# EAGLE design Tractive System Active Light rev6 (EAGLE 9.6.2)

## Sheet 1 of 2
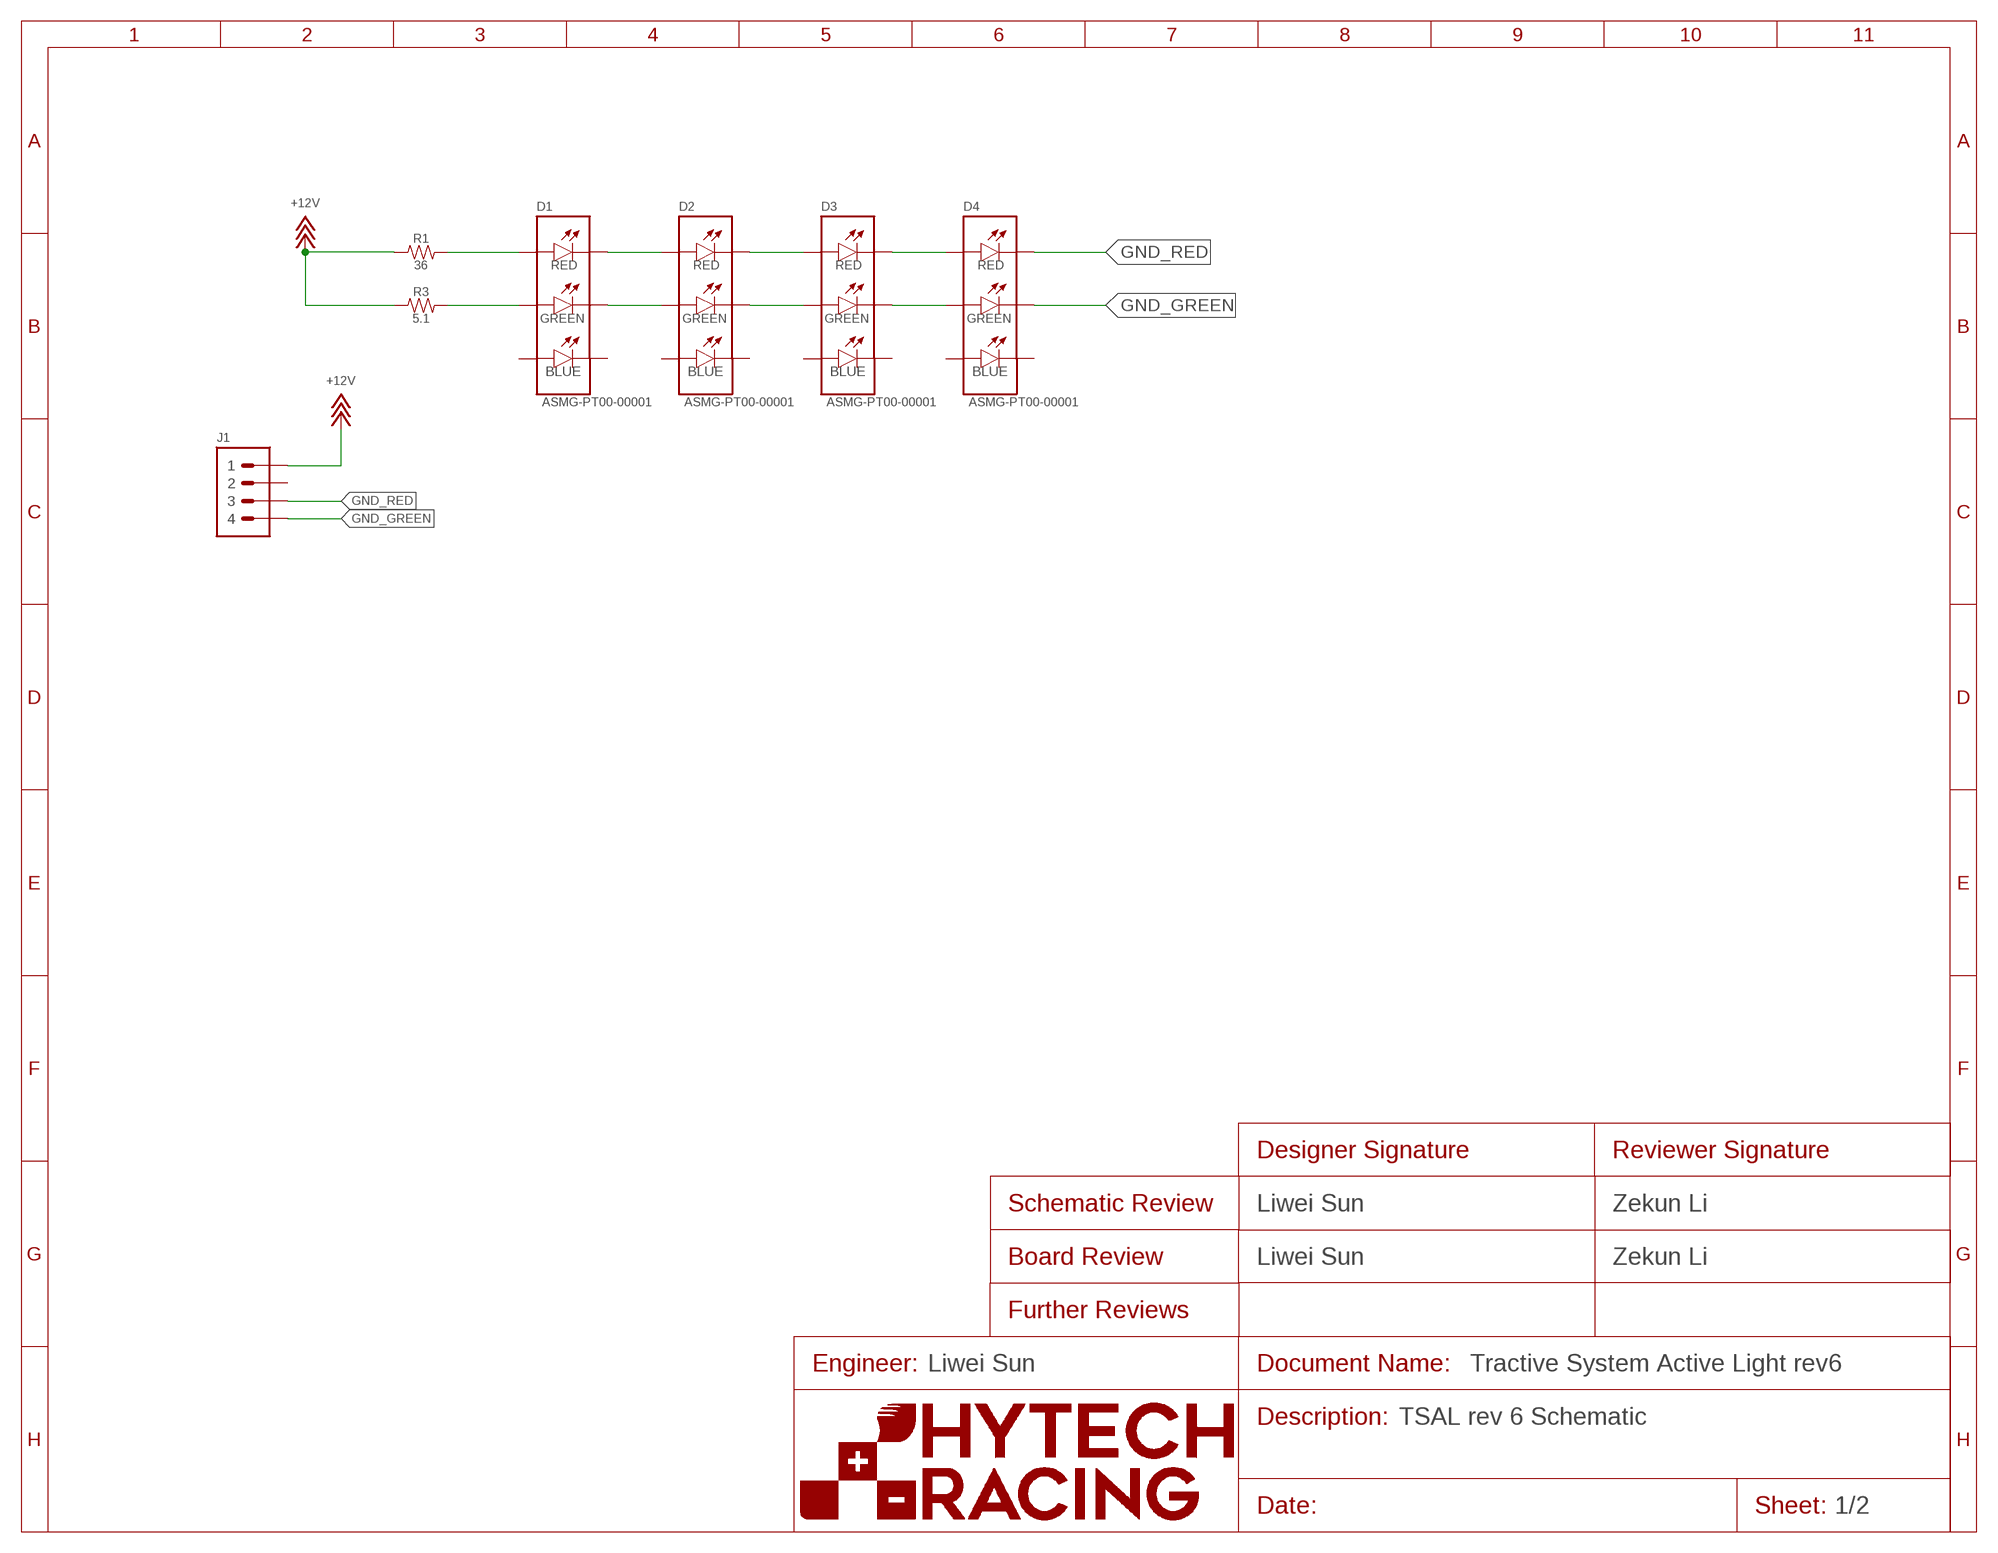
[diagram p0: schematic, sheet 1]
FRAME1 (FRAME): DESCRIPTION_1: TSAL rev 6 Schematic; DESIGNER_BOARD: Liwei Sun; DESIGNER_SCHEMATIC: Liwei Sun; ENGINEER: Liwei Sun; REVIEWER_BOARD: Zekun Li; REVIEWER_SCHEMATIC: Zekun Li

### Parts
D1  LED_RGB_ASMG-PT00-00001  [ASMG-PT00-00001]
D2  LED_RGB_ASMG-PT00-00001  [ASMG-PT00-00001]
D3  LED_RGB_ASMG-PT00-00001  [ASMG-PT00-00001]
D4  LED_RGB_ASMG-PT00-00001  [ASMG-PT00-00001]
J1  CONNECTOR-4_μF_S_RA_  [MOLEX_MICROFIT_SMD_RIGHTANGLE_04_DUAL]
R1  RESISTOR_0805_36  [0805-RES]
R3  RESISTOR_0805_5.1  [0805-RES]

### Nets
+12V: J1.1 R1.1 R3.1
GND_GREEN: D4.2(GREEN-) J1.4
GND_RED: D4.1(RED-) J1.3
N$1: D3.1(RED-) D4.4(RED+) D4.THERMAL(RED+)
N$2: D3.2(GREEN-) D4.5(GREEN+)
N$3: D2.1(RED-) D3.4(RED+) D3.THERMAL(RED+)
N$4: D2.2(GREEN-) D3.5(GREEN+)
N$5: D1.1(RED-) D2.4(RED+) D2.THERMAL(RED+)
N$6: D1.2(GREEN-) D2.5(GREEN+)
N$7: D1.4(RED+) D1.THERMAL(RED+) R1.2
N$9: D1.5(GREEN+) R3.2
Unconnected: D1.3(BLUE-) D1.6(BLUE+) D2.3(BLUE-) D2.6(BLUE+) D3.3(BLUE-) D3.6(BLUE+) D4.3(BLUE-) D4.6(BLUE+) J1.2

## Sheet 2 of 2
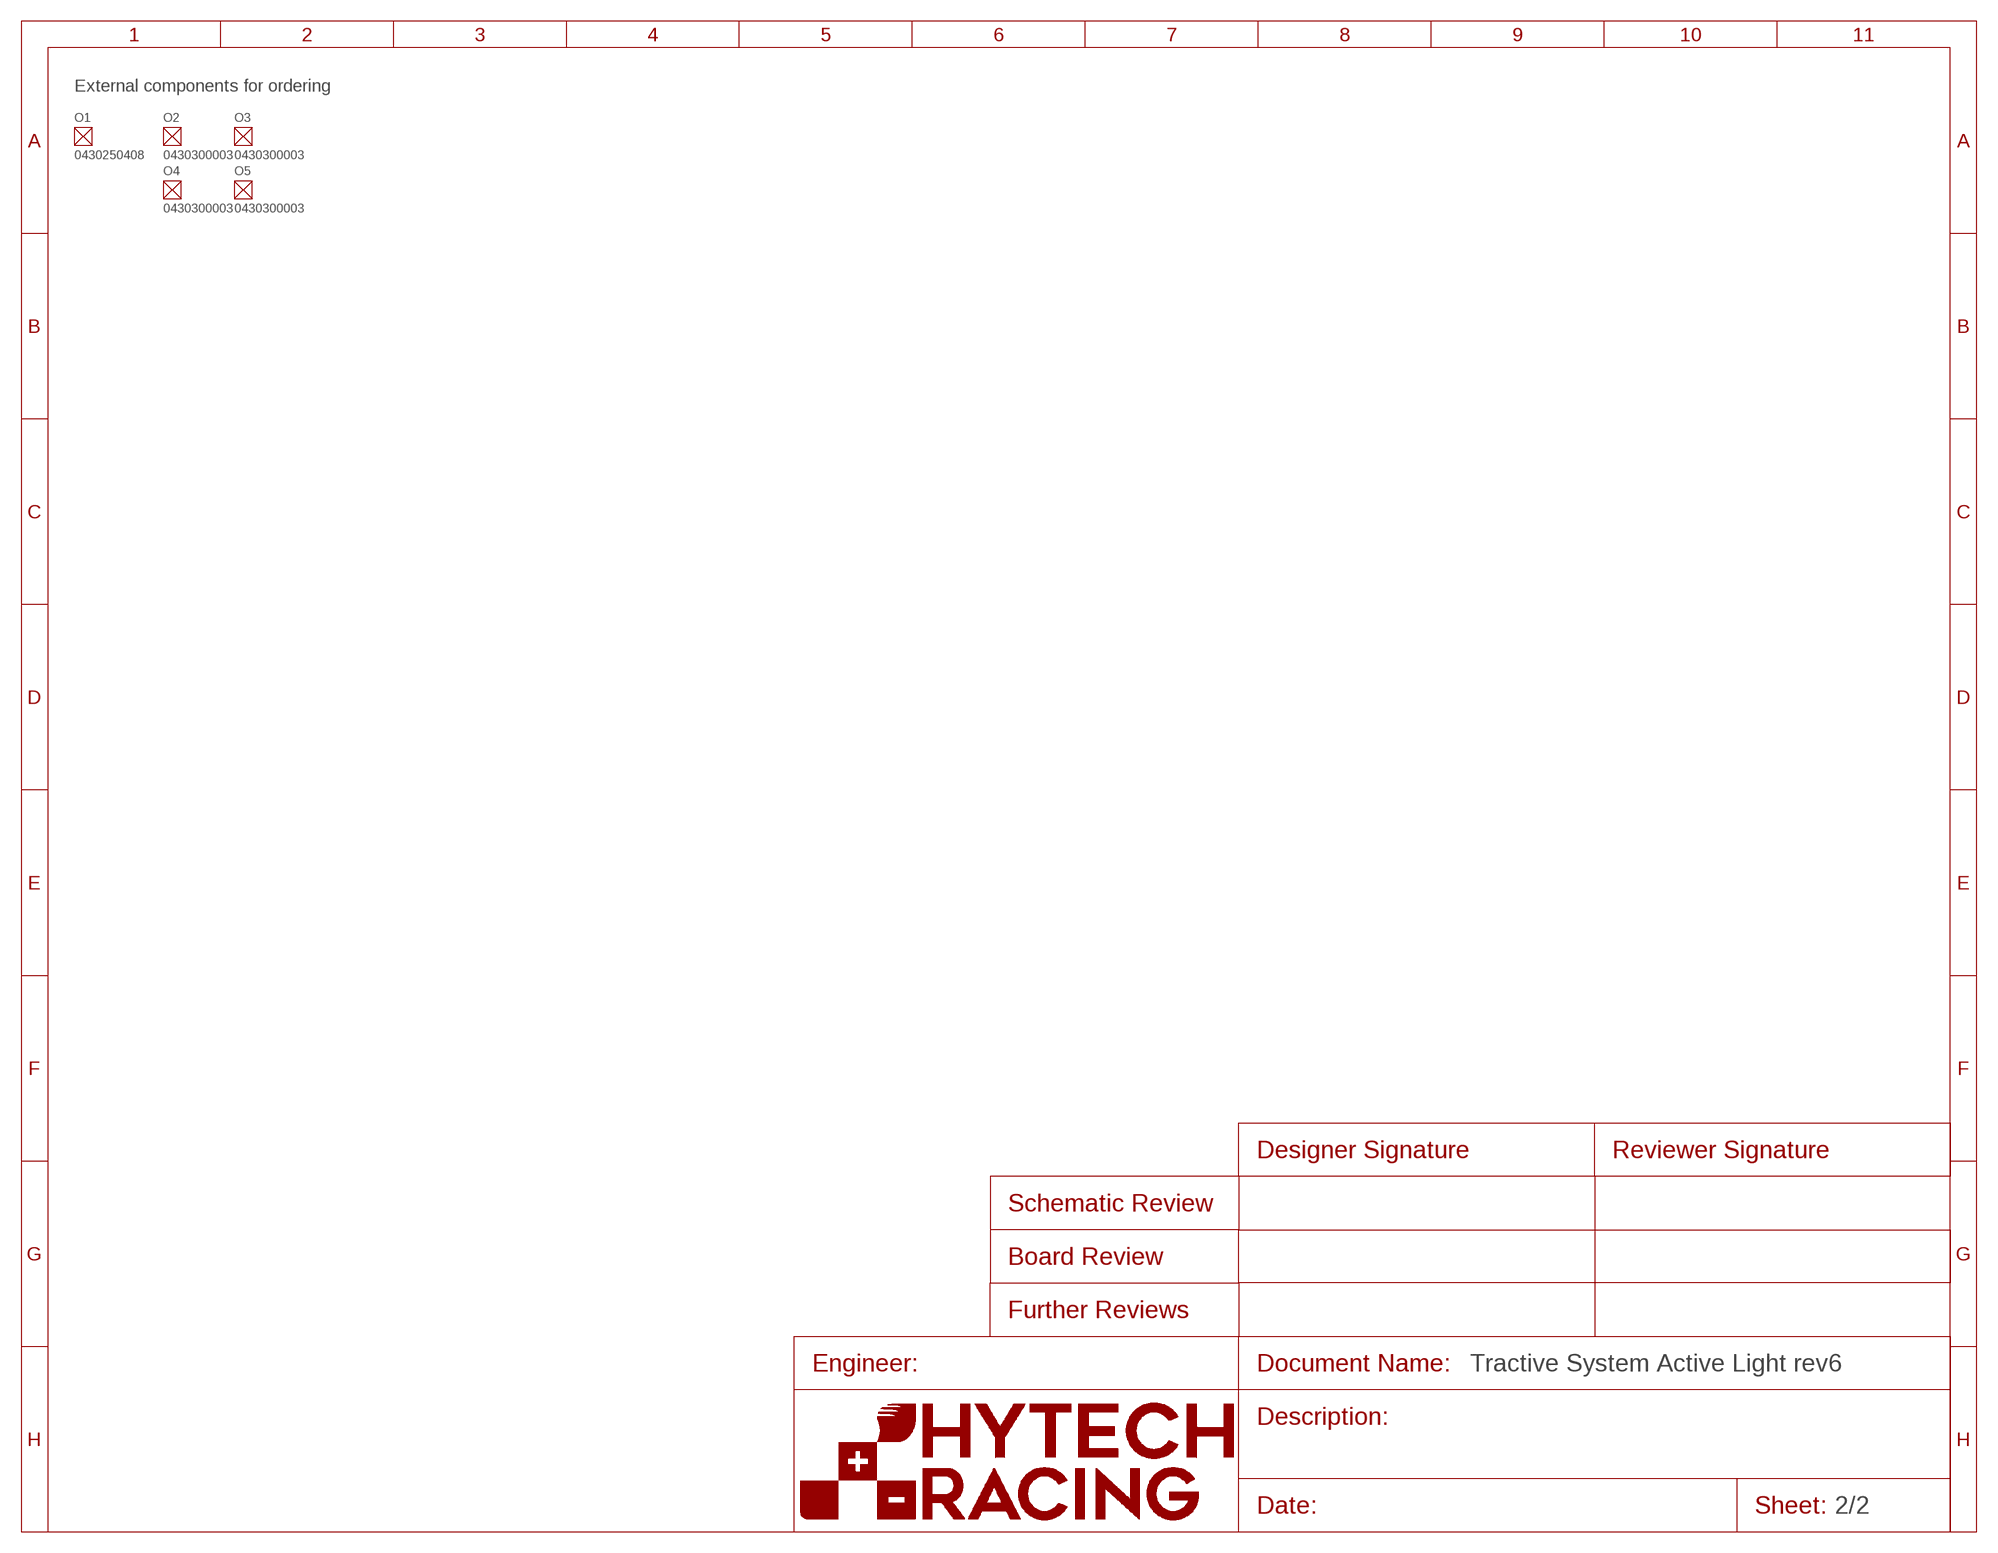
[diagram p1: schematic, sheet 2]
O1 (RECEPTACLE-4_MICROFIT): DKPN: WM11225-ND; MANUFACTURER: Molex; MOPN: 538-43025-0408; MPN: 0430250408
O2 (CRIMP_MICROFIT_20-24): DKPN: WM2776CT-ND; GAUGE: 20-24; MANUFACTURER: Molex; MOPN: 538-43030-0003; MPN: 0430300003
O3 (CRIMP_MICROFIT_20-24): DKPN: WM2776CT-ND; GAUGE: 20-24; MANUFACTURER: Molex; MOPN: 538-43030-0003; MPN: 0430300003
O4 (CRIMP_MICROFIT_20-24): DKPN: WM2776CT-ND; GAUGE: 20-24; MANUFACTURER: Molex; MOPN: 538-43030-0003; MPN: 0430300003
O5 (CRIMP_MICROFIT_20-24): DKPN: WM2776CT-ND; GAUGE: 20-24; MANUFACTURER: Molex; MOPN: 538-43030-0003; MPN: 0430300003

### Notes on the sheet
- External components for ordering

## Library data of the parts
D1-D4 = HyTechDevicesTemp:LED_RGB_*: Broadcom ASMG-PT00-00001 RGB LED Datasheet <https://docs.broadcom.com/doc/ASMG-PT00-DS100>; COLOR: RGB; DKPN: 516-4178-2-ND; MANUFACTURER: Broadcom Limited; MOPN: 630-ASMG-PT00-00001; MPN: ASMG-PT00-00001
J1 = HyTechDevices:CONNECTOR-4_?_*; DKPN: WM1832CT-ND; MANUFACTURER: Molex; MOPN: 538-0430450411; MPN: 0430450411
R1 = HyTechDevices:RESISTOR_?_*: Resistor PWR163 Series <https://www.mouser.com/datasheet/2/54/pwr163-777985.pdf> AC Series <https://www.mouser.com/datasheet/2/447/Yageo_PYu_AC_51_RoHS_L_7_1714230-1874691.pdf> PU Series <https://www.mouser.com/datasheet/2/447/PYu-PU_51_RoHS_L_6-1504619.pdf> ERA Series <https://www.mouser.com/datasheet/2/315/AOA0000C307-1149632.pdf> PWR263 Series <https://www.mouser.com/datasheet/2/54/pwr263s_35-778069.pdf> RC Series <https://www.mouser.com/datasheet/2/447/Yageo_03_18_2021_PYu_RC_Group_51_RoHS_L_11-2199992.pdf> ERJ PB3, PB6 Series <https://www.mouser.com/datasheet/2/315/AOA0000C328-1530132.pdf> ERJ PA2, P03, PA3, P06, P08, P14 Series <https://www.mouser.com/datasheet/2/315/AOA0000C331-1141874.pdf>; DKPN: P36ADTR-ND; MANUFACTURER: Panasonic Electronic Components; MOPN: 667-ERJ-P06J360V; MPN: ERJ-P06J360V; POWER: 0.5W; RESISTANCE: 36; TOLERANCE: 5%; VOLTAGE_CONTINUOUS: 4.243V; VOLTAGE_MAX: 400V
R3 = HyTechDevices:RESISTOR_?_*: Resistor PWR163 Series <https://www.mouser.com/datasheet/2/54/pwr163-777985.pdf> AC Series <https://www.mouser.com/datasheet/2/447/Yageo_PYu_AC_51_RoHS_L_7_1714230-1874691.pdf> PU Series <https://www.mouser.com/datasheet/2/447/PYu-PU_51_RoHS_L_6-1504619.pdf> ERA Series <https://www.mouser.com/datasheet/2/315/AOA0000C307-1149632.pdf> PWR263 Series <https://www.mouser.com/datasheet/2/54/pwr263s_35-778069.pdf> RC Series <https://www.mouser.com/datasheet/2/447/Yageo_03_18_2021_PYu_RC_Group_51_RoHS_L_11-2199992.pdf> ERJ PB3, PB6 Series <https://www.mouser.com/datasheet/2/315/AOA0000C328-1530132.pdf> ERJ PA2, P03, PA3, P06, P08, P14 Series <https://www.mouser.com/datasheet/2/315/AOA0000C331-1141874.pdf>; DKPN: P19237TR-ND; MANUFACTURER: Panasonic Electronic Components; MOPN: 667-ERJ-6DQJ5R1V; MPN: ERJ-6DQJ5R1V; POWER: 0.5W; RESISTANCE: 5.1; TOLERANCE: 5%; VOLTAGE_CONTINUOUS: 1.597V; VOLTAGE_MAX: 400V

## Board
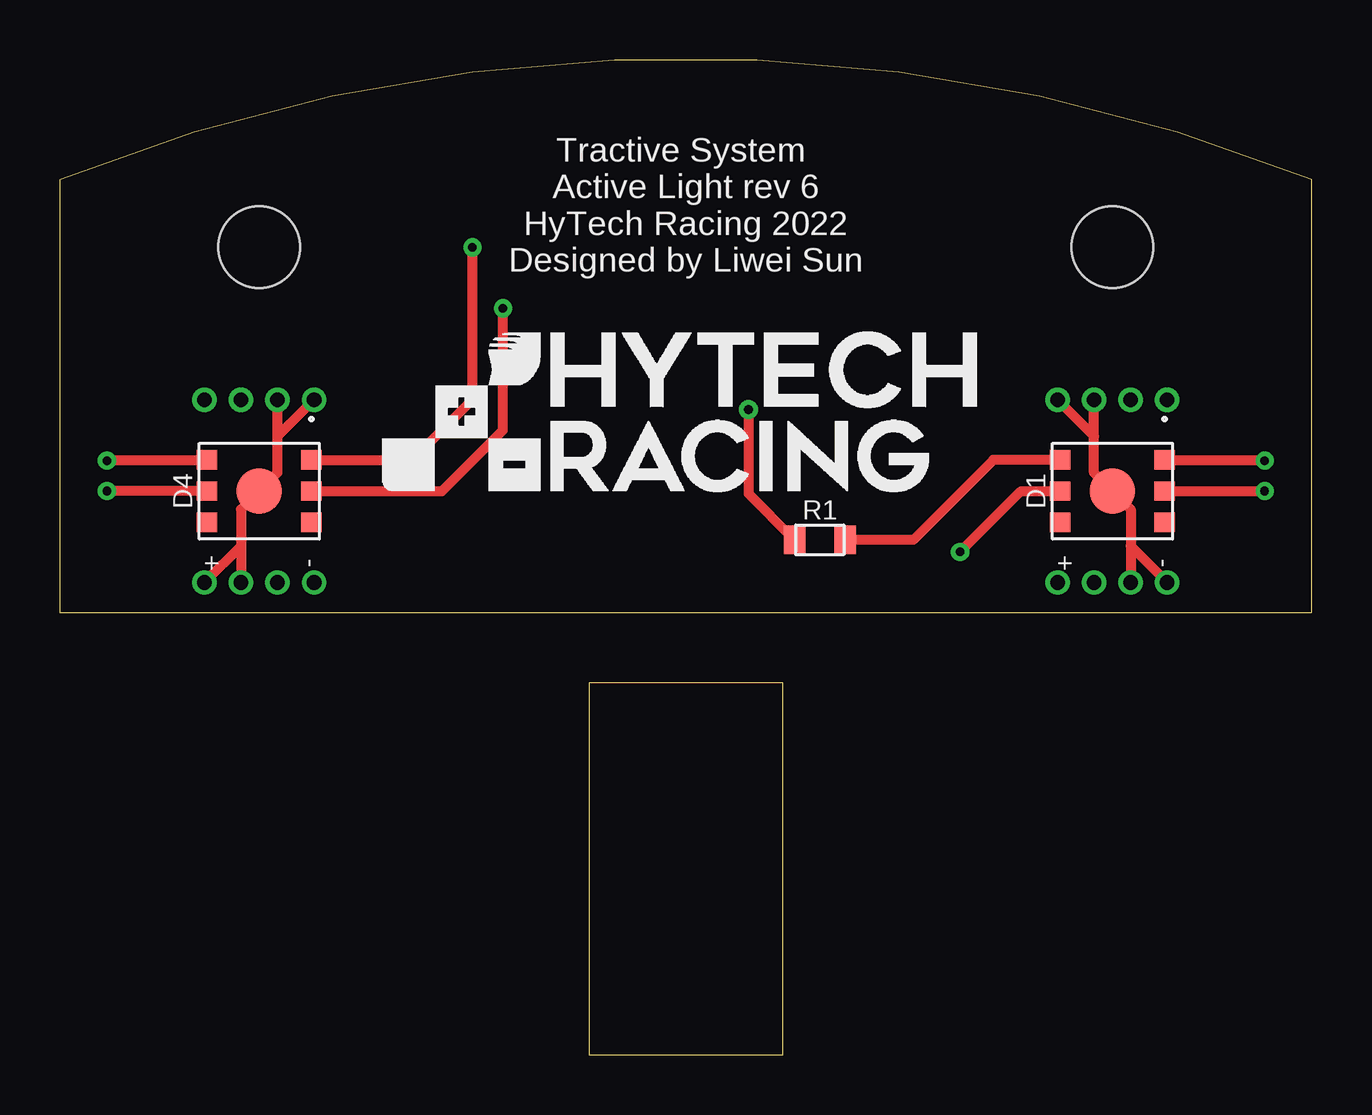
[diagram p2: board, top side]
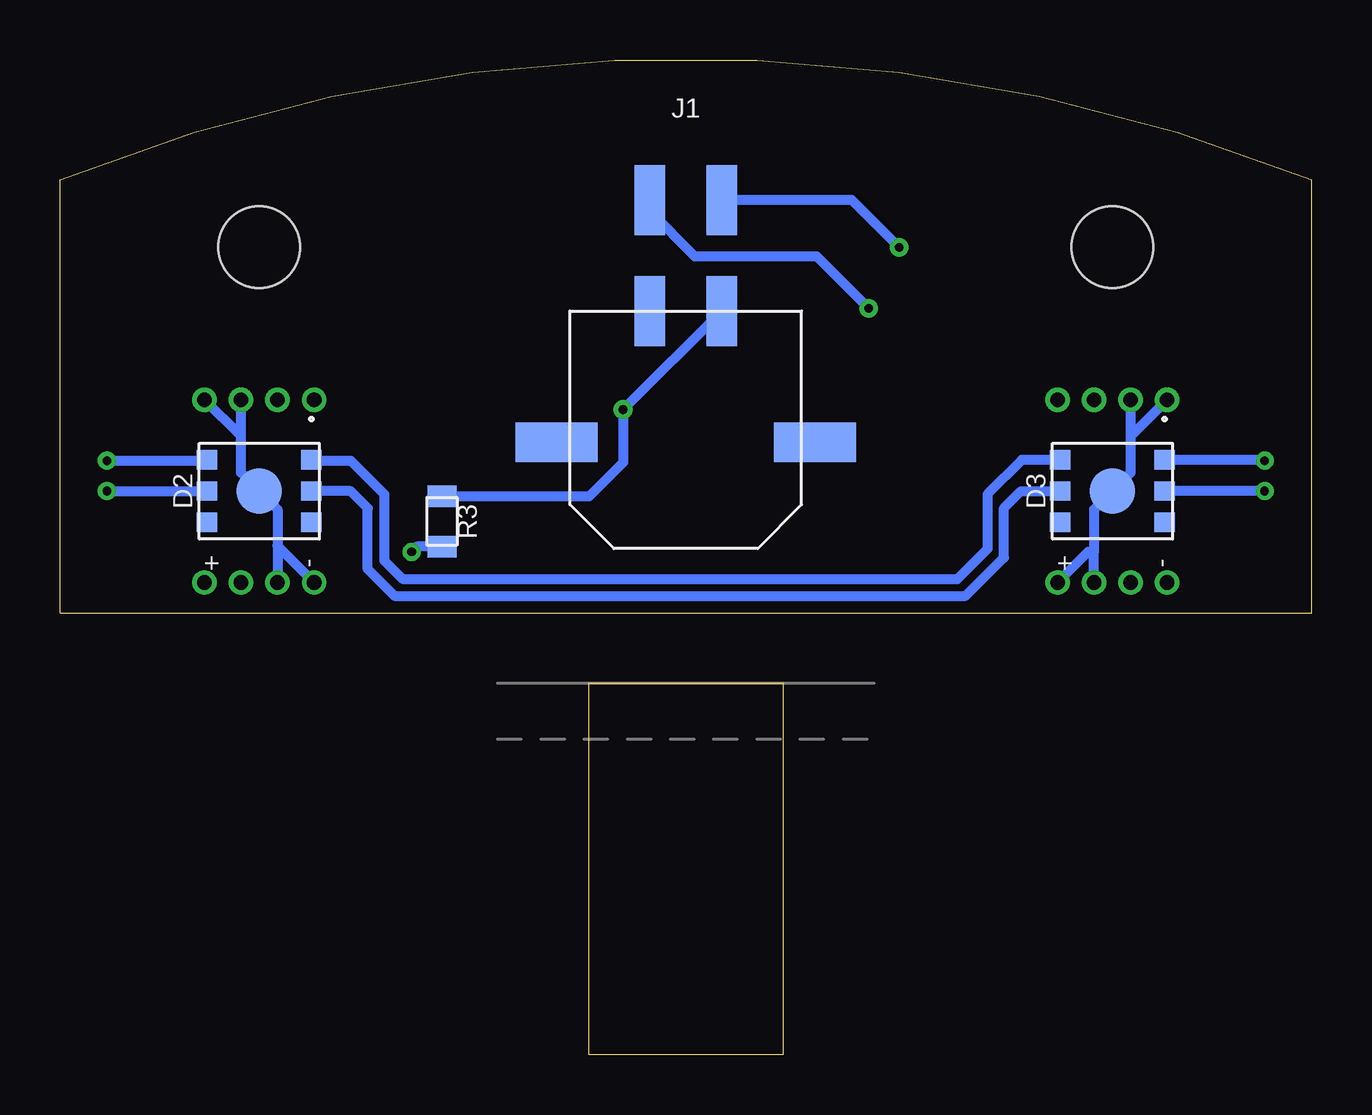
[diagram p3: board, bottom side, seen from below]

Size 52.17 x 23.05 mm. Coordinates in mm from the lower left corner, seen from the top.
Outline: 52.17,0 52.17,18.06 arc44 0,18.06 0,0 52.17,0
Copper layers (1*16): Top 0.035mm / dielectric 1.53mm / Bottom 0.035mm
Design rules "HyTech Default (2 Layer)": minimum track width 6mil, minimum drill 14mil, track to track 6mil, track to pad 6mil, pad to pad 6mil, via to via 20mil, smd to smd 6mil, copper to edge 20mil, drill to drill 21mil, minimum pad ring 7mil, minimum via ring 8mil, stop-mask expansion 6mil, vias tented up to drill 30mil, thermal gap 10mil

### Footprints (pad centres in the part's own frame; a part is rotated, then mirrored left to right if it is on the bottom)
ASMG-PT00-00001 = smd 0.8 x 0.85: 1 1.3,-2.175; 2 0,-2.175; 3 -1.3,-2.175; 4 1.3,2.175; 5 0,2.175; 6 -1.3,2.175 | smd 1.9 x 1.9: THERMAL 0,0
MOLEX_MICROFIT_SMD_RIGHTANGLE_04_DUAL = smd 1.27 x 2.921: 1 1.5,5.474; 2 -1.5,5.474; 3 1.5,10.097; 4 -1.5,10.097 | smd 3.429 x 1.651: PAD1 5.386,0; PAD2 -5.386,0
0805-RES = smd 0.9 x 1.2: 1 -1.05,0; 2 1.05,0
MOUNTING_M3 = hole 3.4: 0,0

### Placement (x,y rotation side)
D1  43.87,5.08 90 top
D2  43.87,5.08 90 bottom
D3  8.31,5.08 90 bottom
D4  8.31,5.08 90 top
J1  26.09,7.11 0 bottom
R1  31.67,3.05 0 top
R3  36.25,3.81 270 bottom
U$1  [MOUNTING_M3]  43.87,15.24 0 top
U$2  [LOGO_HYTECH_MEDIUM]  13.39,5.08 0 top
U$3  [MOUNTING_M3]  8.31,15.24 0 top

### Tracks (layer width: path | path; a pad name or v marks a point on that pad's centre or on a via)
+12V  (via drill 0.38)
  Top 0.406: R1.1 28.7,4.97 v28.7,8.47
  Bottom 0.406: J1.1 v28.7,8.47 28.7,6.27 30.12,4.86 R3.1
GND_GREEN  (via drill 0.36)
  Top 0.406: D4.2 15.93,5.08 18.47,7.62 v18.47,12.7
  Bottom 0.406: v18.47,12.7 20.62,14.86 25.7,14.86 27.59,16.74 J1.4
GND_RED  (via drill 0.36)
  Top 0.406: D4.1 14.69,6.38 17.2,8.89 v17.2,15.24
  Bottom 0.406: v17.2,15.24 19.16,17.21 J1.3
N$1  (via drill 0.36, 0.61)
  Top 0.406: D4.4 6.1,6.35 v1.96,6.35 | 9.07,7.37 9.07,5.84 D4.THERMAL 7.54,4.32 7.54,3.05 7.54,2.79 | 9.07,7.37 v9.07,8.89 | 7.54,2.79 v7.54,1.27 | 9.07,7.37 v10.59,8.89 | 7.54,2.79 v6.02,1.27
  Bottom 0.406: v1.96,6.35 1.99,6.38 D4.4
N$2  (via drill 0.36)
  Top 0.406: D4.5 v1.96,5.08
  Bottom 0.406: v1.96,5.08 D4.5
N$3  (via drill 0.61)
  Bottom 0.406: D2.1 41.66,6.35 40.06,6.35 38.66,4.95 38.66,2.19 37.87,1.4 14.78,1.4 13.51,2.67 13.51,4.95 12.09,6.38 D3.4 | 7.54,7.37 7.54,5.84 D3.THERMAL 9.07,4.32 9.07,2.54 | 7.54,7.37 v7.54,8.89 | v9.07,1.27 9.07,2.54 | 7.54,7.37 v6.02,8.89 | 9.07,2.54 9.32,2.54 v10.59,1.27
N$4
  Bottom 0.406: D2.2 40.06,5.08 39.34,4.37 39.34,1.83 38.23,0.71 14.42,0.71 12.83,2.31 12.83,4.37 12.12,5.08 D3.5
N$5  (via drill 0.36, 0.61)
  Top 0.406: D2.4 50.19,6.38 v50.22,6.35
  Bottom 0.406: v50.22,6.35 46.07,6.35 D2.4 | 44.63,7.37 44.63,5.84 D2.THERMAL 43.1,4.32 43.1,2.79 | 44.63,7.37 v44.63,8.89 | 43.1,2.79 v43.1,1.27 | 44.63,7.37 v46.15,8.89 | 43.1,2.79 v41.58,1.27
N$6  (via drill 0.36)
  Top 0.406: D2.5 v50.22,5.08
  Bottom 0.406: v50.22,5.08 D2.5
N$7  (via drill 0.61)
  Top 0.406: 43.1,7.37 43.1,5.84 D1.THERMAL 44.63,4.32 44.63,2.79 | 43.1,7.37 v43.1,8.89 | 44.63,2.79 v44.63,1.27 | 43.1,7.37 v41.58,8.89 | 44.63,2.79 v46.15,1.27 | D1.4 38.9,6.38 35.56,3.05 R1.2
N$9  (via drill 0.36)
  Top 0.406: v37.52,2.54 40.06,5.08 D1.5
  Bottom 0.406: R3.2 37.3,2.76 v37.52,2.54

### Text on the board
tPlace: Tractive System / Active Light rev 6 / HyTech Racing 2022 / Designed by Liwei Sun